# Altium schematic sheet MicroController.SchDoc
size A3; DocumentNumber: 2; Revision: V1.0; SheetNumber: 2; SheetTotal: 3
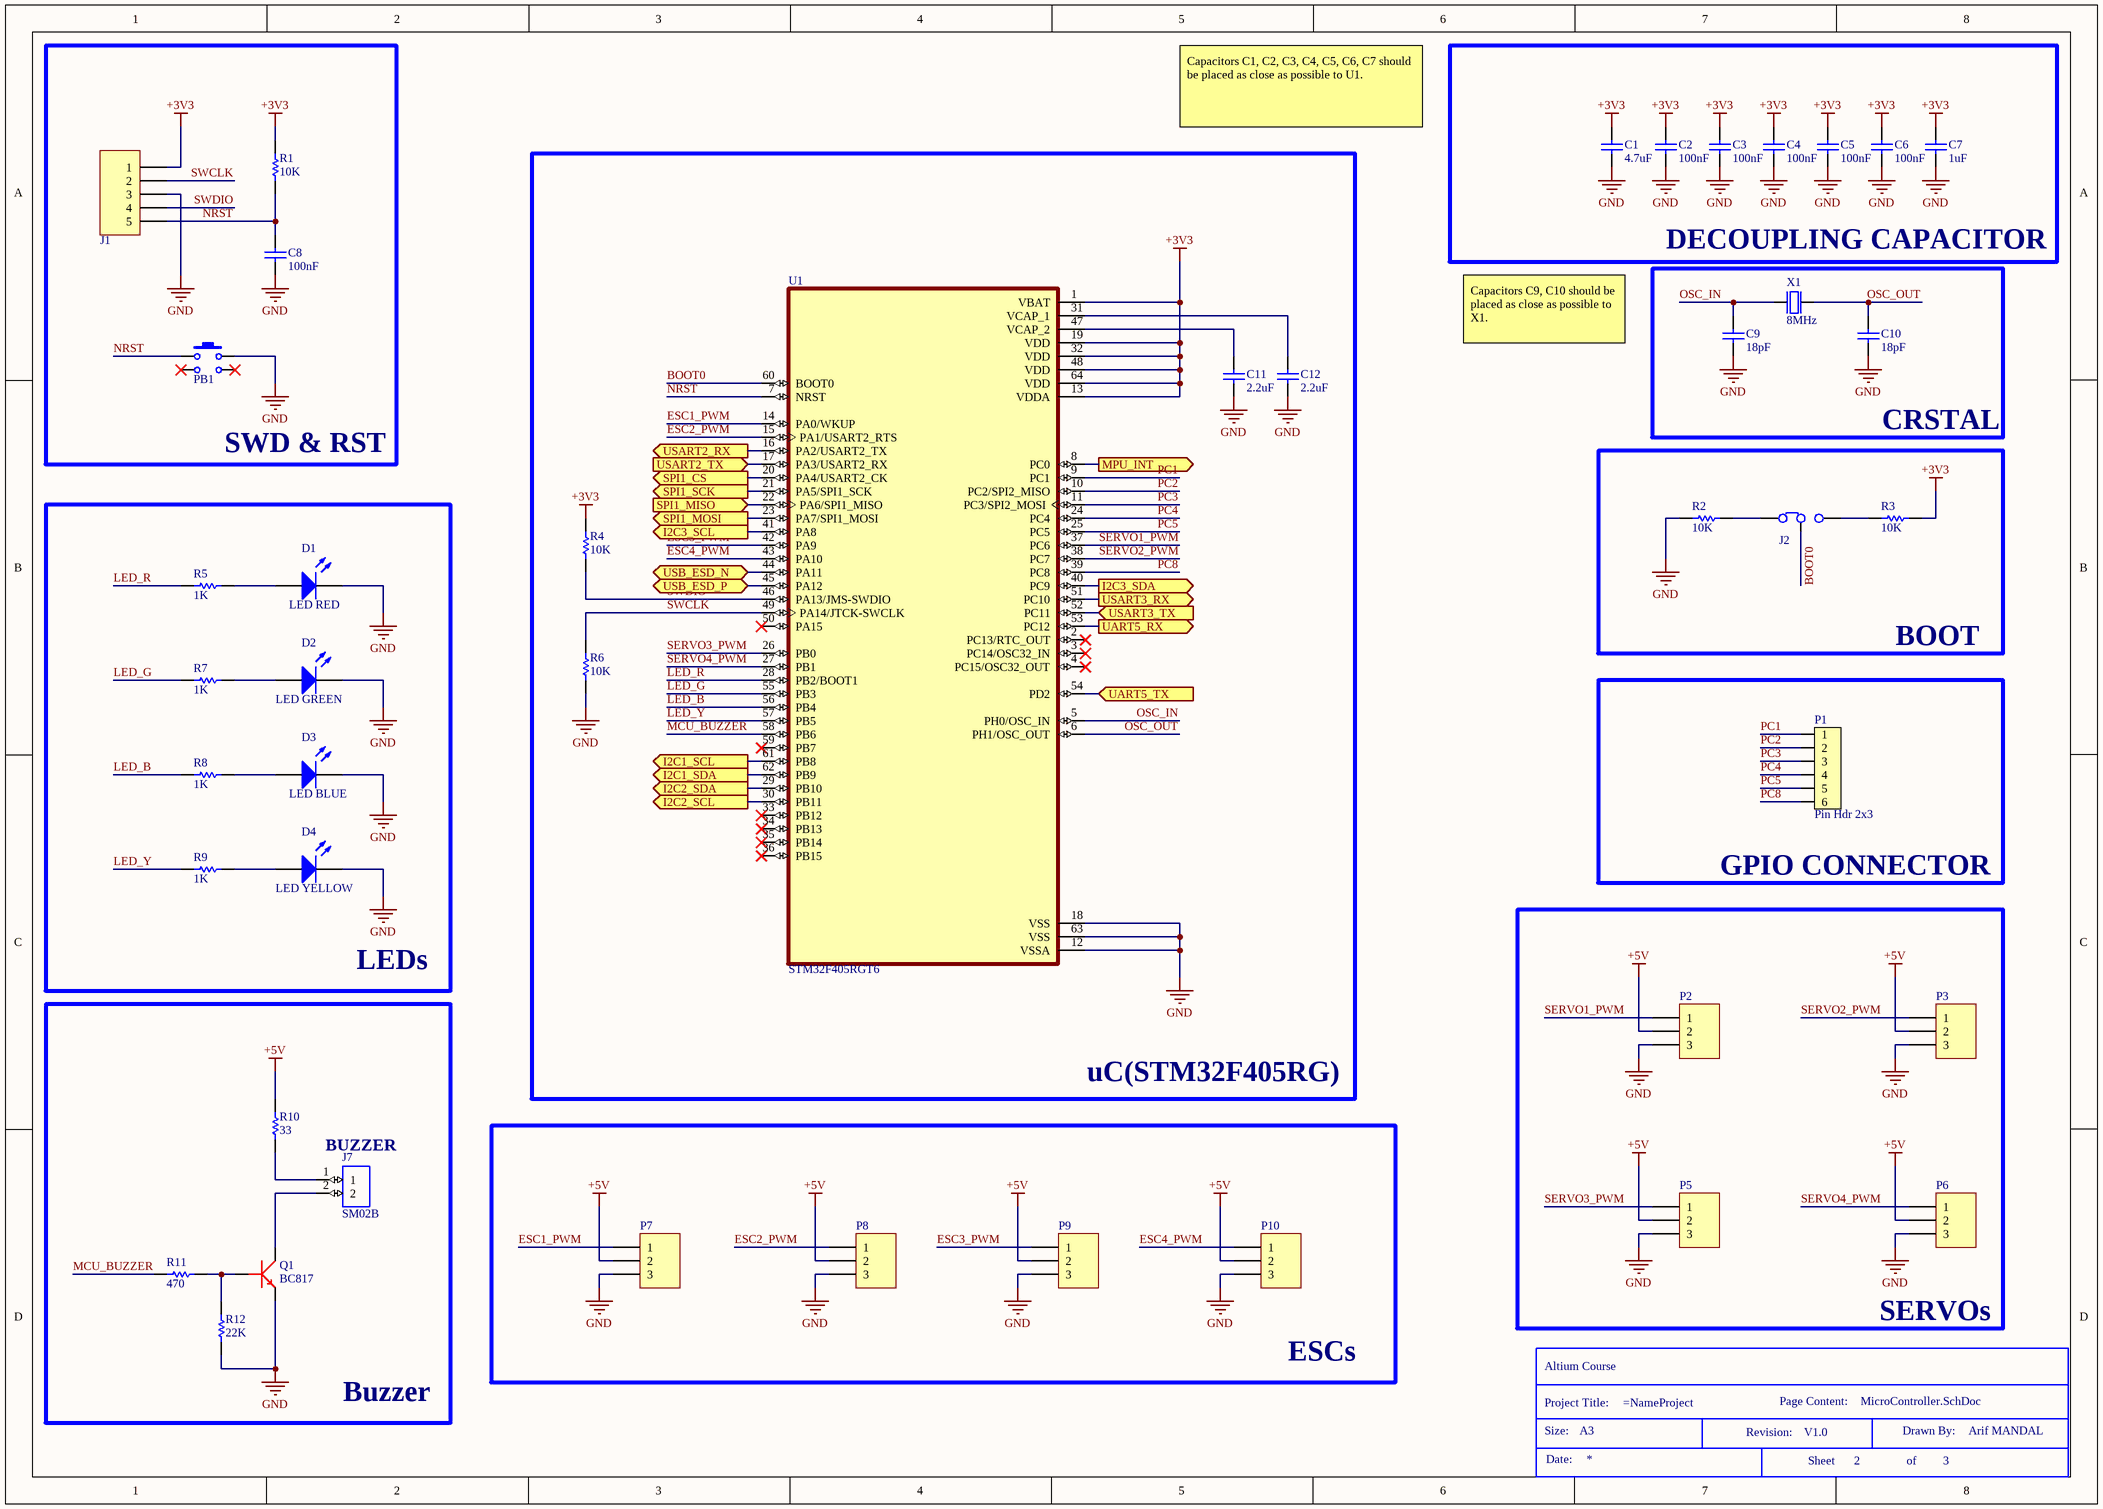
[diagram p0: MicroController.SchDoc]

## Parts
*  Size: A3  Drawn By: Arif MANDAL  (hidden comment: Title Block)  (graphical)
C1  4.7uF  [C805]
C2  100nF  [C805]
C3  100nF  [C805]
C4  100nF  [C805]
C5  100nF  [C805]
C6  100nF  [C805]
C7  1uF  [C805]
C8  100nF  [C805]
C9  18pF  [C805]
C10  18pF  [C805]
C11  2.2uF  [C805]
C12  2.2uF  [C805]
D1  LED RED  [MY_LED_0805]
D2  LED GREEN  [MY_LED_0805]
D3  LED BLUE  [MY_LED_0805]
D4  LED YELLOW  [MY_LED_0805]
J1  CONN-5  [PHDR5]  (value not drawn)
J2  jumper  [jumper-3]  (value not drawn)
J7  SM02B  [SM02B-SRSS-TB(LF)(SN)]
P1  Pin Hdr 2x3  [HDR_2x3-SMD]
P2  Header 3  [My_1X03]  (value not drawn)
P3  Header 3  [My_1X03]  (value not drawn)
P5  Header 3  [My_1X03]  (value not drawn)
P6  Header 3  [My_1X03]  (value not drawn)
P7  Header 3  [My_1X03]  (value not drawn)
P8  Header 3  [My_1X03]  (value not drawn)
P9  Header 3  [My_1X03]  (value not drawn)
P10  Header 3  [My_1X03]  (value not drawn)
PB1  Push Button  [PB-SMD-3]  (value not drawn)
Q1  BC817  [SOT23_3]
R1  10K  [R805]
R2  10K  [R805]
R3  10K  [R805]
R4  10K  [R805]
R5  1K  [R805]
R6  10K  [R805]
R7  1K  [R805]
R8  1K  [R805]
R9  1K  [R805]
R10  33  [R805]
R11  470  [R805]
R12  22K  [R805]
U1  STM32F405RGT6  [QFP-64N]
X1  8MHz  [BT-XTAL_2016]

## Blocks framed on the sheet
SWD & RST: C8 J1 PB1 R1
DECOUPLING CAPACITOR: C1-C7
uC(STM32F405RG): C11 C12 R4 R6 U1
LEDs: D1-D4 R5 R7-R9
GPIO CONNECTOR: P1
SERVOs: P2 P3 P5 P6
Buzzer: J7 Q1 R10-R12
ESCs: P7-P10

## Ports
I2C1_SCL (out), I2C1_SDA (out), I2C2_SCL (out), I2C2_SDA (out), I2C3_SCL (out), I2C3_SDA (out), MPU_INT (out), SPI1_CS (out), SPI1_MISO (in), SPI1_MOSI (out), SPI1_SCK (out), UART5_RX (out), UART5_TX (in), USART2_RX (out), USART2_TX (in), USART3_RX (out), USART3_TX (in), USB_ESD_N (bidir), USB_ESD_P (bidir)

## Nets
+3V3: C1.2 C2.2 C3.2 C4.2 C5.2 C6.2 C7.2 J1.1 R1.2 R3.1 R4.2 U1.1(VBAT) U1.13(VDDA) U1.19(VDD) U1.32(VDD) U1.48(VDD) U1.64(VDD)
+5V: P2.2 P3.2 P5.2 P6.2 P7.2 P8.2 P9.2 P10.2 R10.1
GND: C1.1 C2.1 C3.1 C4.1 C5.1 C6.1 C7.1 C8.1 C9.1 C10.1 C11.1 C12.1 D1.K D2.K D3.K D4.K J1.3 P2.3 P3.3 P5.3 P6.3 P7.3 P8.3 P9.3 P10.3 PB1.2 Q1.2(E) R2.2 R6.1 R12.2 U1.12(VSSA) U1.18(VSS) U1.63(VSS) X1.2(GND) X1.4(GND)
BOOT0: J2.2(C2) U1.60(BOOT0)
ESC1_PWM: P7.1 U1.14(PA0/WKUP)
ESC2_PWM: P8.1 U1.15(PA1/USART2_RTS)
ESC3_PWM: P9.1 U1.42(PA9)
ESC4_PWM: P10.1 U1.43(PA10)
I2C1_SCL: U1.61(PB8) ; port I2C1_SCL
I2C1_SDA: U1.62(PB9) ; port I2C1_SDA
I2C2_SCL: U1.30(PB11) ; port I2C2_SCL
I2C2_SDA: U1.29(PB10) ; port I2C2_SDA
I2C3_SCL: U1.41(PA8) ; port I2C3_SCL
I2C3_SDA: U1.40(PC9) ; port I2C3_SDA
LED_B: R8.2 U1.56(PB4)
LED_G: R7.2 U1.55(PB3)
LED_R: R5.2 U1.28(PB2/BOOT1)
LED_Y: R9.2 U1.57(PB5)
MCU_BUZZER: R11.2 U1.58(PB6)
MPU_INT: U1.8(PC0) ; port MPU_INT
NRST: C8.2 J1.5 PB1.1 R1.1 U1.7(NRST)
OSC_IN: C9.2 U1.5(PH0/OSC_IN) X1.1(inp)
OSC_OUT: C10.2 U1.6(PH1/OSC_OUT) X1.3(out)
PC1: P1.1 U1.9(PC1)
PC2: P1.2 U1.10(PC2/SPI2_MISO)
PC3: P1.3 U1.11(PC3/SPI2_MOSI)
PC4: P1.4 U1.24(PC4)
PC5: P1.5 U1.25(PC5)
PC8: P1.6 U1.39(PC8)
SERVO1_PWM: P2.1 U1.37(PC6)
SERVO2_PWM: P3.1 U1.38(PC7)
SERVO3_PWM: P5.1 U1.26(PB0)
SERVO4_PWM: P6.1 U1.27(PB1)
SPI1_CS: U1.20(PA4/USART2_CK) ; port SPI1_CS
SPI1_MISO: U1.22(PA6/SPI1_MISO) ; port SPI1_MISO
SPI1_MOSI: U1.23(PA7/SPI1_MOSI) ; port SPI1_MOSI
SPI1_SCK: U1.21(PA5/SPI1_SCK) ; port SPI1_SCK
SWCLK: J1.2 R6.2 U1.49(PA14/JTCK-SWCLK)
SWDIO: J1.4 R4.1 U1.46(PA13/JMS-SWDIO)
UART5_RX: U1.53(PC12) ; port UART5_RX
UART5_TX: U1.54(PD2) ; port UART5_TX
USART2_RX: U1.16(PA2/USART2_TX) ; port USART2_RX
USART2_TX: U1.17(PA3/USART2_RX) ; port USART2_TX
USART3_RX: U1.51(PC10) ; port USART3_RX
USART3_TX: U1.52(PC11) ; port USART3_TX
USB_ESD_N: U1.44(PA11) ; port USB_ESD_N
USB_ESD_P: U1.45(PA12) ; port USB_ESD_P
NetC11_2: C11.2 U1.47(VCAP_2)
NetC12_2: C12.2 U1.31(VCAP_1)
NetD1_A: D1.A R5.1
NetD2_A: D2.A R7.1
NetD3_A: D3.A R8.1
NetD4_A: D4.A R9.1
NetJ2_1: J2.1(C1) R2.1
NetJ2_3: J2.3(C3) R3.2
NetJ7_1: J7.1 R10.2
NetJ7_2: J7.2 Q1.3(C)
NetQ1_1: Q1.1(B) R11.1 R12.1

Not connected (* = marked no-connect by the designer): PB1 3* 4*; U1 2(PC13/RTC_OUT)* 3(PC14/OSC32_IN)* 4(PC15/OSC32_OUT)* 33(PB12)* 34(PB13)* 35(PB14)* 36(PB15)* 50(PA15)* 59(PB7)*

## Notes on the sheet
- Capacitors C1, C2, C3, C4, C5, C6, C7 should be placed as close as possible to U1.
- Capacitors C9, C10 should be placed as close as possible to X1.
- CRSTAL
- BOOT
- (near J7) BUZZER
- (in symbol Title Block) Altium Course; Project Title:; Page Content:; Size:; Drawn By:; Revision:; Date:; Sheet; of

## Library data of the parts
C1-C12 = Cap: Capacitor; Designer: Parsa Malekpour
  C1: Value: 4.7uF
  C2-C6 C8: Value: 100nF
  C7: Value: 1uF
  C9 C10: Value: 18pF
  C11 C12: Value: 2.2uF
D1-D4 = LED: Typical INFRARED GaAs LED; ASiD Part Number: LED-AS
J2 = Triple Jumper: Jumper wire
J7 = SM02B-SRSS-TB(LF)(SN): Connector Header Surface Mount, Right Angle 2 position 0.039 _1.00mm_; MP: SM02B-SRSS-TB_LF__SN_; MF: JST Sales; SnapEDA_Link: https://www.snapeda.com/parts/SM02B-SRSS-TB%28LF%29%28SN%29/JST%20Sales%20America%20Inc./view-part/447499/?ref=snap; Price: None; Value: *; Availability: Unavailable; Package: None
P1 = Pin Header 2x3 SMD: Pin Header 2x3, 2.54mm (100mil) SMD; Manufacturer: W-CON; Manufacturer Part Number: 1125-1203S0M116R1; Part number IPS: 00000009966; Artikkelnr Noca: 55010007; Pad Count: 6; Part Number: Pin Header 2x3 SMD; Footprint Doc: HDR_2x3-SMD; LatestRevisionDate: 2016-01-22; Published: 2016-01-22; Value: Pin Hdr 2x3; Note: SMD; ComponentLink1URL: N.A.; ComponentLink1Description: Datasheet; ComponentLink2URL: N.A.; ComponentLink2Description: Supplier link; HelpURL: \\hizz\pro\app9717\Datasheet\connectors\W-CON\1125-12XXXXMXXXXX.PDF; Supplier 1: Cabcon; Supplier Part Number 1: 1125-1203S0M116R1; Supplier 2: Samtec; Supplier Part Number 2: TSM-103-01-L-DV; Component Class: Connectors; PartId: 100500242
P2 P3 P5-P10 = Header 3: Header, 3-Pin; ASiD Part Number: Header 3-AS
PB1 = SWITCH-PB
Q1 = bc817-16
R1-R12 = Resistor: Designer: Parsa Malekpour
  R1-R4 R6: Value: 10K
  R5 R7-R9: Value: 1K
  R10: Value: 33
  R11: Value: 470
  R12: Value: 22K
U1 = STM32F405RGT6: High-performance foundation line, ARM Cortex-M4 core with DSP and FPU, 1 Mbyte Flash, 168 MHz CPU, ART Accelerator; MP: STM32F405RGT6; Value: *; Purchase Link: https://ozdisan.com/Product/Detail/492033/STM32F405RGT6V; Package: 64LQFP; Availability: Unavailable
X1 = XTAL_SMD2016_32MHz_8pF_Golledge: XTAL SMD 2016, 32MHz, Cl=8pF, Tol: ±10ppm, Stab: ±15ppm; Manufacturer Part Number: MP06003; Part number IPS: 00000001431; Note: XTAL SMD 32.000MHz; Artikkelnr Noca: 22010050; Pad Count: 4; Part Number: XTAL_SMD2016_32MHz_8pF_Golledge; LatestRevisionDate: 2016-11-02; Published: 2016-11-02; Value: 8MHz; Footprint Doc: XTAL_2016; Manufacturer: Golledge; ComponentLink1URL: N.A.; ComponentLink1Description: Datasheet; ComponentLink2URL: N.A.; ComponentLink2Description: Supplier link; HelpURL: \\hizz\pro\app9717\Datasheet\crystals\Golledge\mp06003.pdf; Supplier 1: Link Nordic; Supplier Part Number 1: N.A.; Supplier 2: N.A.; Supplier Part Number 2: N.A.; Component Class: Oscillators; PartId: 101600041